# EAGLE design tinypico-fc (EAGLE 9.1.1)
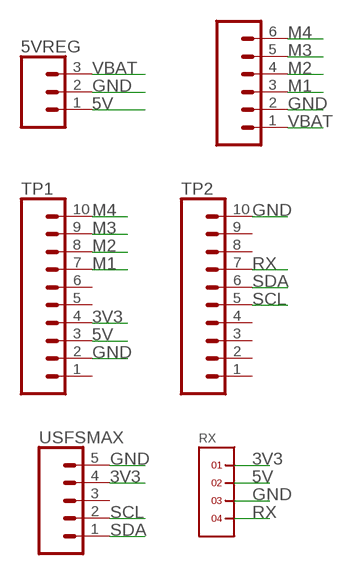
[diagram p0: schematic, sheet 1]

## Parts
5VREG  CONN_031X03_NO_SILK  [1X03_NO_SILK]
ESC  CONN_06NO_SILK_FEMALE_PTH  [1X06_NO_SILK]
RX  1X4  [1X4]
TP1  CONN_10NO_SILK_PTH_FEMALE  [1X10_NO_SILK]
TP2  CONN_10NO_SILK_PTH_FEMALE  [1X10_NO_SILK]
USFSMAX  CONN_05NO_SILK  [1X05_NO_SILK]

## Nets
3V3: RX.1 TP1.4 USFSMAX.4
5V: 5VREG.1 RX.2 TP1.3
GND: 5VREG.2 ESC.2 RX.3 TP1.2 TP2.10 USFSMAX.5
M1: ESC.3 TP1.7
M2: ESC.4 TP1.8
M3: ESC.5 TP1.9
M4: ESC.6 TP1.10
RX: RX.4 TP2.7
SCL: TP2.5 USFSMAX.2
SDA: TP2.6 USFSMAX.1
VBAT: 5VREG.3 ESC.1
Unconnected: TP1.1 TP1.5 TP1.6 TP2.1 TP2.2 TP2.3 TP2.4 TP2.8 TP2.9 USFSMAX.3

## Library data of the parts
5VREG = SparkFun-Connectors:CONN_03: Multi connection point. Often used as Generic Header-pin footprint for 0.1 inch spaced/style header connections On any of the 0.1 inch spaced packages, you can populate with these: Break Away Headers - Straight <https://www.sparkfun.com/products/116> (PRT-00116) Break Away Male Headers - Right Angle <https://www.sparkfun.com/products/553> (PRT-00553) Female Headers <https://www.sparkfun.com/products/115> (PRT-00115) Break Away Headers - Machine Pin <https://www.sparkfun.com/products/117> (PRT-00117) Break Away Female Headers - Swiss Machine Pin <https://www.sparkfun.com/products/743> (PRT-00743) Stackable Header - 3 Pin (Female, 0.1") <https://www.sparkfun.com/products/13875> (PRT-13875) For SCREWTERMINALS and SPRING TERMINALS visit here: Screw Terimnals on SparkFun.com <https://www.sparkfun.com/search/results?term=Screw+Terminals> (5mm/3.5mm/2.54mm spacing) This device is also useful as a general connection point to wire up your design to another part of your project. Our various solder wires solder well into these plated through hole pads. Hook-Up Wire - Assortment (Stranded, 22 AWG) <https://www.sparkfun.com/products/11375> (PRT-11375) Hook-Up Wire - Assortment (Solid Core, 22 AWG) <https://www.sparkfun.com/products/11367> (PRT-11367) View the entire wire category on our website here <https://www.sparkfun.com/categories/141> Special notes: Molex polarized connector foot print use with SKU : PRT-08232 with associated crimp pins and housings.
ESC = SparkFun-Connectors:CONN_06: Multi connection point. Often used as Generic Header-pin footprint for 0.1 inch spaced/style header connections On any of the 0.1 inch spaced packages, you can populate with these: Break Away Headers - Straight <https://www.sparkfun.com/products/116> (PRT-00116) Break Away Male Headers - Right Angle <https://www.sparkfun.com/products/553> (PRT-00553) Female Headers <https://www.sparkfun.com/products/115> (PRT-00115) Break Away Headers - Machine Pin <https://www.sparkfun.com/products/117> (PRT-00117) Break Away Female Headers - Swiss Machine Pin <https://www.sparkfun.com/products/743> (PRT-00743) Arduino Stackable Header - 6 Pin <https://www.sparkfun.com/products/9280> (PRT-09280) For SCREWTERMINALS and SPRING TERMINALS visit here: Screw Terimnals on SparkFun.com <https://www.sparkfun.com/search/results?term=Screw+Terminals> (5mm/3.5mm/2.54mm spacing) This device is also useful as a general connection point to wire up your design to another part of your project. Our various solder wires solder well into these plated through hole pads. Hook-Up Wire - Assortment (Stranded, 22 AWG) <https://www.sparkfun.com/products/11375> (PRT-11375) Hook-Up Wire - Assortment (Solid Core, 22 AWG) <https://www.sparkfun.com/products/11367> (PRT-11367) View the entire wire category on our website here <https://www.sparkfun.com/categories/141>; PROD_ID: CONN-08437
RX = headers(2mm):1X4
TP1 TP2 = SparkFun-Connectors:CONN_10: Multi connection point. Often used as Generic Header-pin footprint for 0.1 inch spaced/style header connections On any of the 0.1 inch spaced packages, you can populate with these: Break Away Headers - Straight <https://www.sparkfun.com/products/116> (PRT-00116) Break Away Male Headers - Right Angle <https://www.sparkfun.com/products/553> (PRT-00553) Female Headers <https://www.sparkfun.com/products/115> (PRT-00115) Break Away Headers - Machine Pin <https://www.sparkfun.com/products/117> (PRT-00117) Break Away Female Headers - Swiss Machine Pin <https://www.sparkfun.com/products/743> (PRT-00743) Arduino Stackable Header - 10 Pin <https://www.sparkfun.com/products/11376> (PRT-11376) For SCREWTERMINALS and SPRING TERMINALS visit here: Screw Terimnals on SparkFun.com <https://www.sparkfun.com/search/results?term=Screw+Terminals> (5mm/3.5mm/2.54mm spacing) This device is also useful as a general connection point to wire up your design to another part of your project. Our various solder wires solder well into these plated through hole pads. Hook-Up Wire - Assortment (Stranded, 22 AWG) <https://www.sparkfun.com/products/11375> (PRT-11375) Hook-Up Wire - Assortment (Solid Core, 22 AWG) <https://www.sparkfun.com/products/11367> (PRT-11367) View the entire wire category on our website here <https://www.sparkfun.com/categories/141> Special notes: Molex polarized connector foot print use with SKU : PRT-08231 with associated crimp pins and housings. 1MM SMD Version SKU: PRT-10208 NOTES ON THE VARIANTS LOCK and LOCK_LONGPADS... This footprint was designed to help hold the alignment of a through-hole component (i.e. 6-pin header) while soldering it into place. You may notice that each hole has been shifted either up or down by 0.005 of an inch from it's more standard position (which is a perfectly straight line). This slight alteration caused the pins (the squares in the middle) to touch the edges of the holes. Because they are alternating, it causes a "brace" to hold the component in place. 0.005 has proven to be the perfect amount of "off-center" position when using our standard breakaway headers. Although looks a little odd when you look at the bare footprint, once you have a header in there, the alteration is very hard to notice. Also,if you push a header all the way into place, it is covered up entirely on the bottom side.
USFSMAX = SparkFun-Connectors:CONN_05: Multi connection point. Often used as Generic Header-pin footprint for 0.1 inch spaced/style header connections On any of the 0.1 inch spaced packages, you can populate with these: Break Away Headers - Straight <https://www.sparkfun.com/products/116> (PRT-00116) Break Away Male Headers - Right Angle <https://www.sparkfun.com/products/553> (PRT-00553) Female Headers <https://www.sparkfun.com/products/115> (PRT-00115) Break Away Headers - Machine Pin <https://www.sparkfun.com/products/117> (PRT-00117) Break Away Female Headers - Swiss Machine Pin <https://www.sparkfun.com/products/743> (PRT-00743) For SCREWTERMINALS and SPRING TERMINALS visit here: Screw Terimnals on SparkFun.com <https://www.sparkfun.com/search/results?term=Screw+Terminals> (5mm/3.5mm/2.54mm spacing) This device is also useful as a general connection point to wire up your design to another part of your project. Our various solder wires solder well into these plated through hole pads. Hook-Up Wire - Assortment (Stranded, 22 AWG) <https://www.sparkfun.com/products/11375> (PRT-11375) Hook-Up Wire - Assortment (Solid Core, 22 AWG) <https://www.sparkfun.com/products/11367> (PRT-11367) View the entire wire category on our website here <https://www.sparkfun.com/categories/141> Special notes: Molex polarized connector foot print use with SKU : PRT-08231 with associated crimp pins and housings. 1MM SMD Version SKU: PRT-10208

## Board
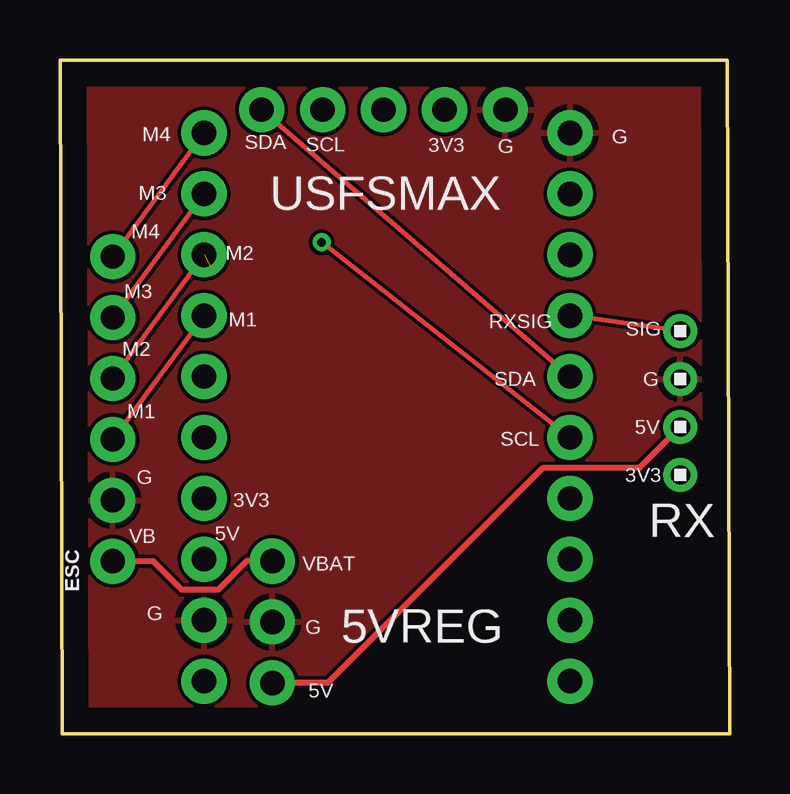
[diagram p1: board, top side]
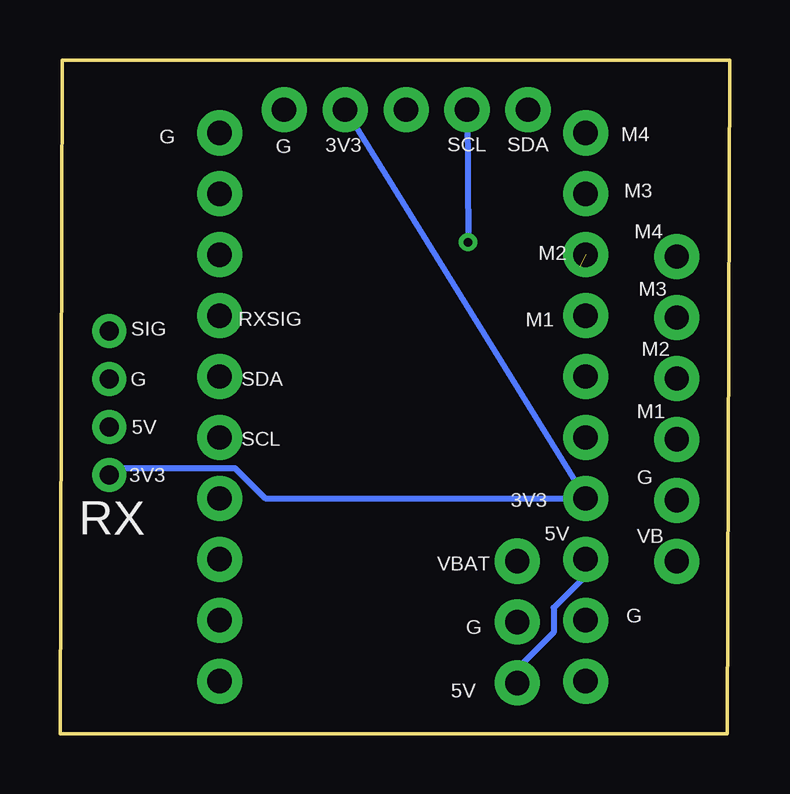
[diagram p2: board, bottom side, seen from below]

Size 27.9 x 28.1 mm. Coordinates in mm from the lower left corner, seen from the top.
Outline: 0,28.1 27.8,28.1 27.9,0 0.1,0 0,28.1
Copper layers (1*16): Top 0.035mm / dielectric 1.5mm / Bottom 0.035mm
Design rules "default": minimum track width 6mil, minimum drill 0.35mm, track to track 6mil, track to pad 6mil, pad to pad 6mil, via to via 6mil, smd to smd 6mil, copper to edge 40mil, drill to drill 6mil, minimum pad ring 10mil, minimum via ring 8mil, stop-mask expansion 4mil, vias tented up to drill 0mil, thermal gap 10mil

### Footprints (pad centres in the part's own frame; a part is rotated, then mirrored left to right if it is on the bottom)
1X03_NO_SILK = drill 1.016 pad 1.88: 1 0,0; 2 2.54,0; 3 5.08,0
1X06_NO_SILK = drill 1.016 pad 1.88: 1 0,0; 2 2.54,0; 3 5.08,0; 4 7.62,0; 5 10.16,0; 6 12.7,0
1X4 = drill 0.8 pad 1.422: 1 -3,0; 2 -1,0; 3 1,0; 4 3,0
1X10_NO_SILK = drill 1.016 pad 1.88: 1 0,0; 2 2.54,0; 3 5.08,0; 4 7.62,0; 5 10.16,0; 6 12.7,0; 7 15.24,0; 8 17.78,0; 9 20.32,0; 10 22.86,0
1X05_NO_SILK = drill 1.016 pad 1.88: 1 0,0; 2 2.54,0; 3 5.08,0; 4 7.62,0; 5 10.16,0

### Placement (x,y rotation side)
5VREG  8.85,2.12 90 top
ESC  2.2,7.2 90 top
RX  25.85,13.8 90 top
TP1  6,2.2 90 top
TP2  21.25,2.2 90 top
USFSMAX  8.4,26.03 0 top

### Tracks (layer width: path | path; a pad name or v marks a point on that pad's centre or on a via)
3V3
  Bottom 0.254: RX.1 25.56,11.09 20.62,11.09 19.35,9.82 TP1.4 USFSMAX.4
5V
  Top 0.254: RX.2 24.14,11.09 20.12,11.09 11.15,2.12 5VREG.1
  Bottom 0.254: 5VREG.1 8.85,2.71 7.33,4.23 7.33,5.26 5.82,6.78
  Bottom 0.305: TP1.3 5.82,6.78
GND
  pour Top: -1.3,28.8 28.8,28.8 28.8,-2.1 -1.3,-2.1
M1
  Top 0.203: TP1.7 ESC.3
M2  (1 unrouted)
  Top 0.203: TP1.8 ESC.4
  Bottom 0.152: 6.25,19.48 6.25,19.47
M3
  Top 0.203: TP1.9 ESC.5
M4
  Top 0.203: TP1.10 ESC.6
RX
  Top 0.203: RX.4 TP2.7
SCL  (via drill 0.35)
  Top 0.203: v10.9,20.5 TP2.5
  Bottom 0.254: USFSMAX.2 v10.9,20.5
SDA
  Top 0.203: USFSMAX.1 TP2.6
VBAT
  Top 0.254: 5VREG.3 7.78,7.21 6.58,6.01 5.07,6.01 3.88,7.2 ESC.1

### Text on the board
tPlace: USFSMAX
bPlace: RXSIG | SCL
tNames: M4 | SDA | SCL | 3V3 | G | G | M3 | M4 | M2 | M3 | M1 | RXSIG | SIG | M2 | SDA | G | M1 | 5V | SCL | G | 3V3 | 3V3 | VB | 5V | RX | VBAT | G | G | 5VREG | 5V
bNames: M4 | SDA | SCL | 3V3 | G | G | M3 | M4 | M2 | M3 | M1 | SIG | M2 | SDA | G | M1 | 5V | G | 3V3 | 3V3 | RX | VB | 5V | VBAT | G | G | 5V